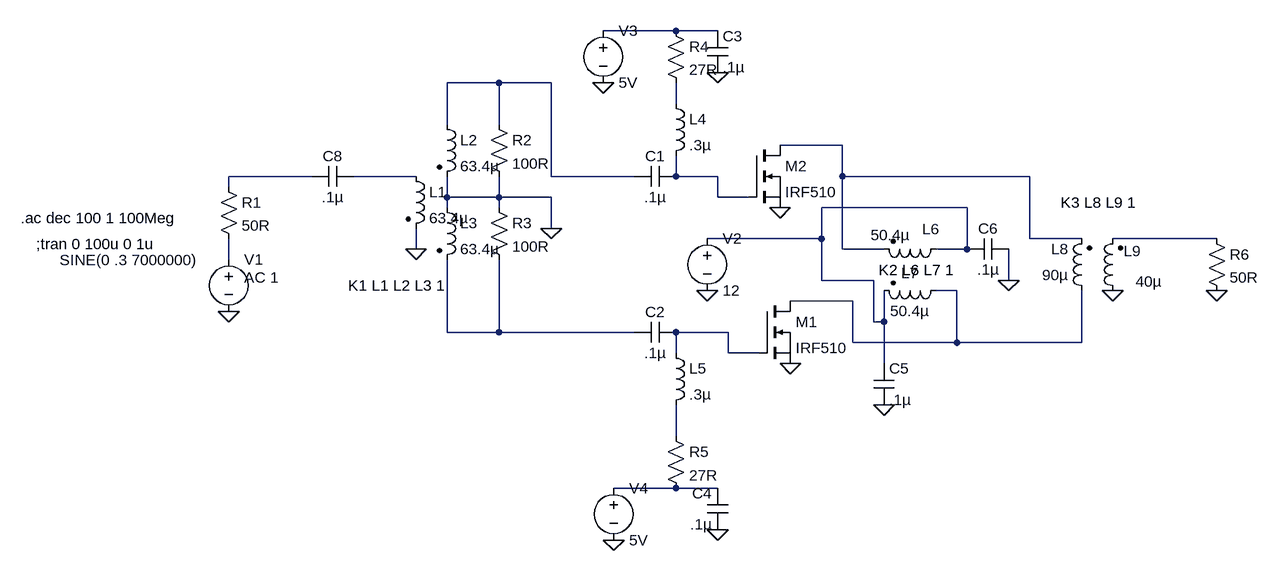
[diagram p0: schematic WA2EBY Amp.asc]
WA2EBY Amp.asc, the LTspice schematic file:
Version 4
SHEET 1 1640 692
WIRE 736 -112 624 -112
WIRE 800 -112 736 -112
WIRE 464 -32 384 -32
WIRE 544 -32 464 -32
WIRE 736 0 736 -32
WIRE 384 32 384 -32
WIRE 464 32 464 -32
WIRE 992 64 896 64
WIRE 176 112 48 112
WIRE 336 112 240 112
WIRE 544 112 544 -32
WIRE 672 112 544 112
WIRE 736 112 736 80
WIRE 800 112 736 112
WIRE 992 112 992 64
WIRE 1280 112 992 112
WIRE 48 128 48 112
WIRE 384 144 384 112
WIRE 464 144 464 112
WIRE 464 144 384 144
WIRE 544 144 464 144
WIRE 800 144 800 112
WIRE 848 144 800 144
WIRE 384 160 384 144
WIRE 464 160 464 144
WIRE 1184 160 960 160
WIRE 544 192 544 144
WIRE 960 208 960 160
WIRE 960 208 784 208
WIRE 1280 208 1280 112
WIRE 1360 208 1280 208
WIRE 1568 208 1408 208
WIRE 336 224 336 192
WIRE 992 224 992 112
WIRE 1056 224 992 224
WIRE 1184 224 1184 160
WIRE 1184 224 1136 224
WIRE 48 240 48 208
WIRE 960 272 960 208
WIRE 1040 272 960 272
WIRE 1248 272 1248 224
WIRE 1168 288 1136 288
WIRE 1008 304 912 304
WIRE 1040 336 1040 272
WIRE 1056 336 1056 288
WIRE 1056 336 1040 336
WIRE 384 352 384 240
WIRE 464 352 464 240
WIRE 464 352 384 352
WIRE 672 352 464 352
WIRE 816 352 736 352
WIRE 1008 368 1008 304
WIRE 1168 368 1168 288
WIRE 1168 368 1008 368
WIRE 1360 368 1360 288
WIRE 1360 368 1168 368
WIRE 736 384 736 352
WIRE 816 384 816 352
WIRE 864 384 816 384
WIRE 1056 400 1056 336
WIRE 736 512 736 464
WIRE 736 592 640 592
WIRE 800 592 736 592
FLAG 48 320 0
FLAG 624 -32 0
FLAG 800 -48 0
FLAG 800 656 0
FLAG 640 672 0
FLAG 896 160 0
FLAG 912 400 0
FLAG 784 288 0
FLAG 1248 272 0
FLAG 1056 464 0
FLAG 1408 288 0
FLAG 1568 288 0
FLAG 336 224 0
FLAG 544 192 0
SYMBOL voltage 48 224 R0
WINDOW 3 -260 17 Left 2
WINDOW 123 24 44 Left 2
WINDOW 39 -260 45 Left 2
SYMATTR Value SINE(0 .3 7000000)
SYMATTR Value2 AC 1
SYMATTR InstName V1
SYMBOL cap 672 128 R270
WINDOW 0 32 32 VTop 2
WINDOW 3 0 32 VBottom 2
SYMATTR InstName C1
SYMATTR Value .1µ
SYMBOL cap 672 368 R270
WINDOW 0 32 32 VTop 2
WINDOW 3 0 32 VBottom 2
SYMATTR InstName C2
SYMATTR Value .1µ
SYMBOL voltage 624 -128 R0
WINDOW 123 0 0 Left 2
WINDOW 39 0 0 Left 2
SYMATTR InstName V3
SYMATTR Value 5V
SYMBOL ind 720 -16 R0
SYMATTR InstName L4
SYMATTR Value .3µ
SYMBOL ind 720 368 R0
SYMATTR InstName L5
SYMATTR Value .3µ
SYMBOL res 720 -128 R0
SYMATTR InstName R4
SYMATTR Value 27R
SYMBOL cap 784 -112 R0
SYMATTR InstName C3
SYMATTR Value .1µ
SYMBOL cap 816 656 R180
WINDOW 0 24 56 Left 2
WINDOW 3 24 8 Left 2
SYMATTR InstName C4
SYMATTR Value .1µ
SYMBOL voltage 640 576 R0
WINDOW 123 0 0 Left 2
WINDOW 39 0 0 Left 2
SYMATTR InstName V4
SYMATTR Value 5V
SYMBOL res 720 496 R0
SYMATTR InstName R5
SYMATTR Value 27R
SYMBOL ind2 1152 208 R90
WINDOW 0 1 24 VBottom 2
WINDOW 3 -21 86 VTop 2
SYMATTR InstName L6
SYMATTR Value 50.4µ
SYMATTR Type ind
SYMATTR SpiceLine Rser=1
SYMBOL ind2 1152 272 R90
WINDOW 0 4 56 VBottom 2
WINDOW 3 32 56 VTop 2
SYMATTR InstName L7
SYMATTR Value 50.4µ
SYMATTR Type ind
SYMATTR SpiceLine Rser=1
SYMBOL voltage 784 192 R0
WINDOW 123 0 0 Left 2
WINDOW 39 0 0 Left 2
SYMATTR InstName V2
SYMATTR Value 12
SYMBOL cap 1040 400 R0
SYMATTR InstName C5
SYMATTR Value .1µ
SYMBOL cap 1184 240 R270
WINDOW 0 32 32 VTop 2
WINDOW 3 0 32 VBottom 2
SYMATTR InstName C6
SYMATTR Value .1µ
SYMBOL ind2 1376 304 R180
WINDOW 0 36 80 Left 2
WINDOW 3 36 40 Left 2
SYMATTR InstName L8
SYMATTR Value 90µ
SYMATTR Type ind
SYMATTR SpiceLine Rser=1
SYMBOL ind2 1424 304 R180
WINDOW 0 -28 77 Left 2
WINDOW 3 -60 30 Left 2
SYMATTR InstName L9
SYMATTR Value 40µ
SYMATTR Type ind
SYMATTR SpiceLine Rser=1
SYMBOL res 1552 192 R0
SYMATTR InstName R6
SYMATTR Value 50R
SYMATTR SpiceLine pwr=20
SYMBOL res 32 112 R0
SYMATTR InstName R1
SYMATTR Value 50R
SYMBOL cap 240 96 R90
WINDOW 0 0 32 VBottom 2
WINDOW 3 32 32 VTop 2
SYMATTR InstName C8
SYMATTR Value .1µ
SYMBOL ind2 320 96 R0
SYMATTR InstName L1
SYMATTR Value 63.4µ
SYMATTR Type ind
SYMBOL ind2 368 16 R0
SYMATTR InstName L2
SYMATTR Value 63.4µ
SYMATTR Type ind
SYMBOL ind2 368 144 R0
SYMATTR InstName L3
SYMATTR Value 63.4µ
SYMATTR Type ind
SYMBOL res 448 16 R0
SYMATTR InstName R2
SYMATTR Value 100R
SYMBOL res 448 144 R0
SYMATTR InstName R3
SYMATTR Value 100R
SYMBOL nmos 864 304 R0
SYMATTR InstName M1
SYMATTR Value IRF510
SYMBOL nmos 848 64 R0
SYMATTR InstName M2
SYMATTR Value IRF510
TEXT -248 216 Left 2 !;tran 0 100u 0 1u
TEXT 1048 256 Left 2 !K2 L6 L7 1
TEXT 1328 152 Left 2 !K3 L8 L9 1
TEXT 232 280 Left 2 !K1 L1 L2 L3 1
TEXT -272 176 Left 2 !.ac dec 100 1 100Meg

The netlist it stands for:
* WA2EBY Amp.asc
V1 N010 0 SINE(0 .3 7000000) AC 1
C1 N002 N007 .1µ
C2 N012 N013 .1µ
V3 N001 0 5V
L4 N003 N007 .3µ
L5 N013 N014 .3µ
R4 N001 N003 27R
C3 N001 0 .1µ
C4 0 N015 .1µ
V4 N015 0 5V
R5 N014 N015 27R
L6 N008 N004 50.4µ Rser=1
L7 N011 N008 50.4µ Rser=1
V2 N008 0 12
C5 N008 0 .1µ
C6 N008 0 .1µ
L8 N011 N004 90µ Rser=1
L9 0 N009 40µ Rser=1
R6 N009 0 50R pwr=20
R1 N005 N010 50R
C8 N006 N005 .1µ
L1 N006 0 63.4µ
L2 N002 0 63.4µ
L3 0 N012 63.4µ
R2 N002 0 100R
R3 0 N012 100R
M1 N011 N013 0 0 IRF510
M2 N004 N007 0 0 IRF510
.model NMOS NMOS
.model PMOS PMOS
.lib standard.mos
;tran 0 100u 0 1u
K2 L6 L7 1
K3 L8 L9 1
K1 L1 L2 L3 1
.ac dec 100 1 100Meg
.backanno
.end